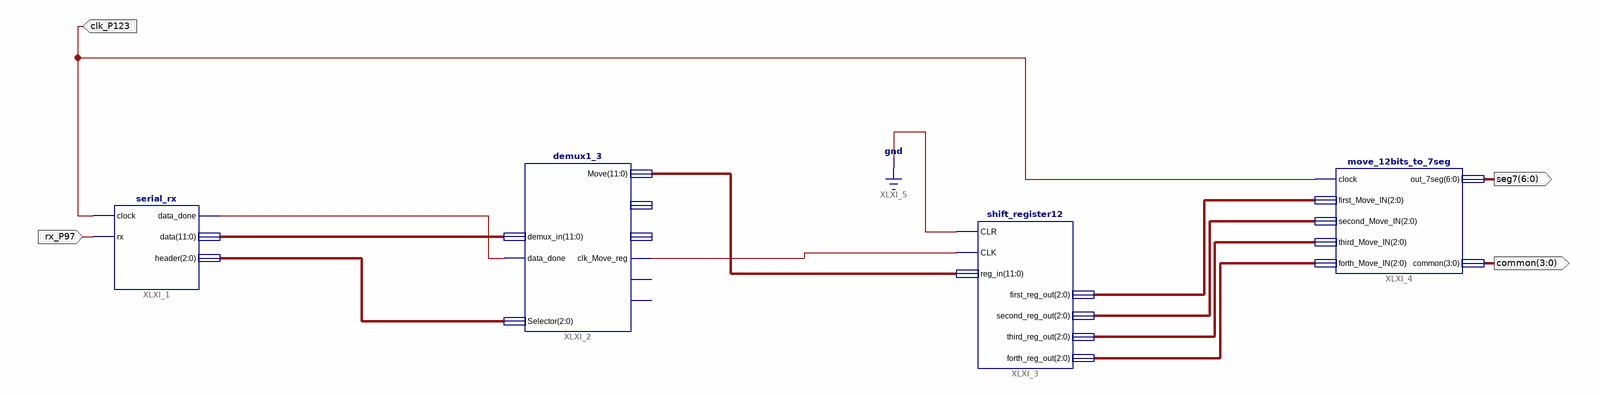
[diagram p0: schematic sheet 1]
// Xilinx ISE schematic main_sch.sch (spartan6) as structural Verilog: 4 symbols, 4 ports
module main_sch (
  input  rx_P97,
  input  clk_P123,
  output [6:0] seg7,
  output [3:0] common
);

  wire XLXN_20, XLXN_25;
  wire [2:0] XLXN_59, XLXN_61, XLXN_62, XLXN_63, XLXN_64;
  wire [11:0] XLXN_23, XLXN_60;

  serial_rx XLXI_1 (.clock(clk_P123), .rx(rx_P97), .data_done(XLXN_20), .header(XLXN_59), .data(XLXN_60));
  demux1_3 XLXI_2 (
    .data_done(XLXN_20), .demux_in(XLXN_60), .Selector(XLXN_59), .clk_Move_reg(XLXN_25), .Move(XLXN_23));  // open: clk_Error_reg, clk_Promote_reg, Error, Promote
  shift_register12 XLXI_3 (
    .CLR(1'b0), .CLK(XLXN_25), .reg_in(XLXN_23), .first_reg_out(XLXN_61), .second_reg_out(XLXN_62),
    .third_reg_out(XLXN_63), .forth_reg_out(XLXN_64));
  move_12bits_to_7seg XLXI_4 (
    .clock(clk_P123), .first_Move_IN(XLXN_61), .second_Move_IN(XLXN_62), .third_Move_IN(XLXN_63),
    .forth_Move_IN(XLXN_64), .out_7seg(seg7), .common(common));
endmodule
